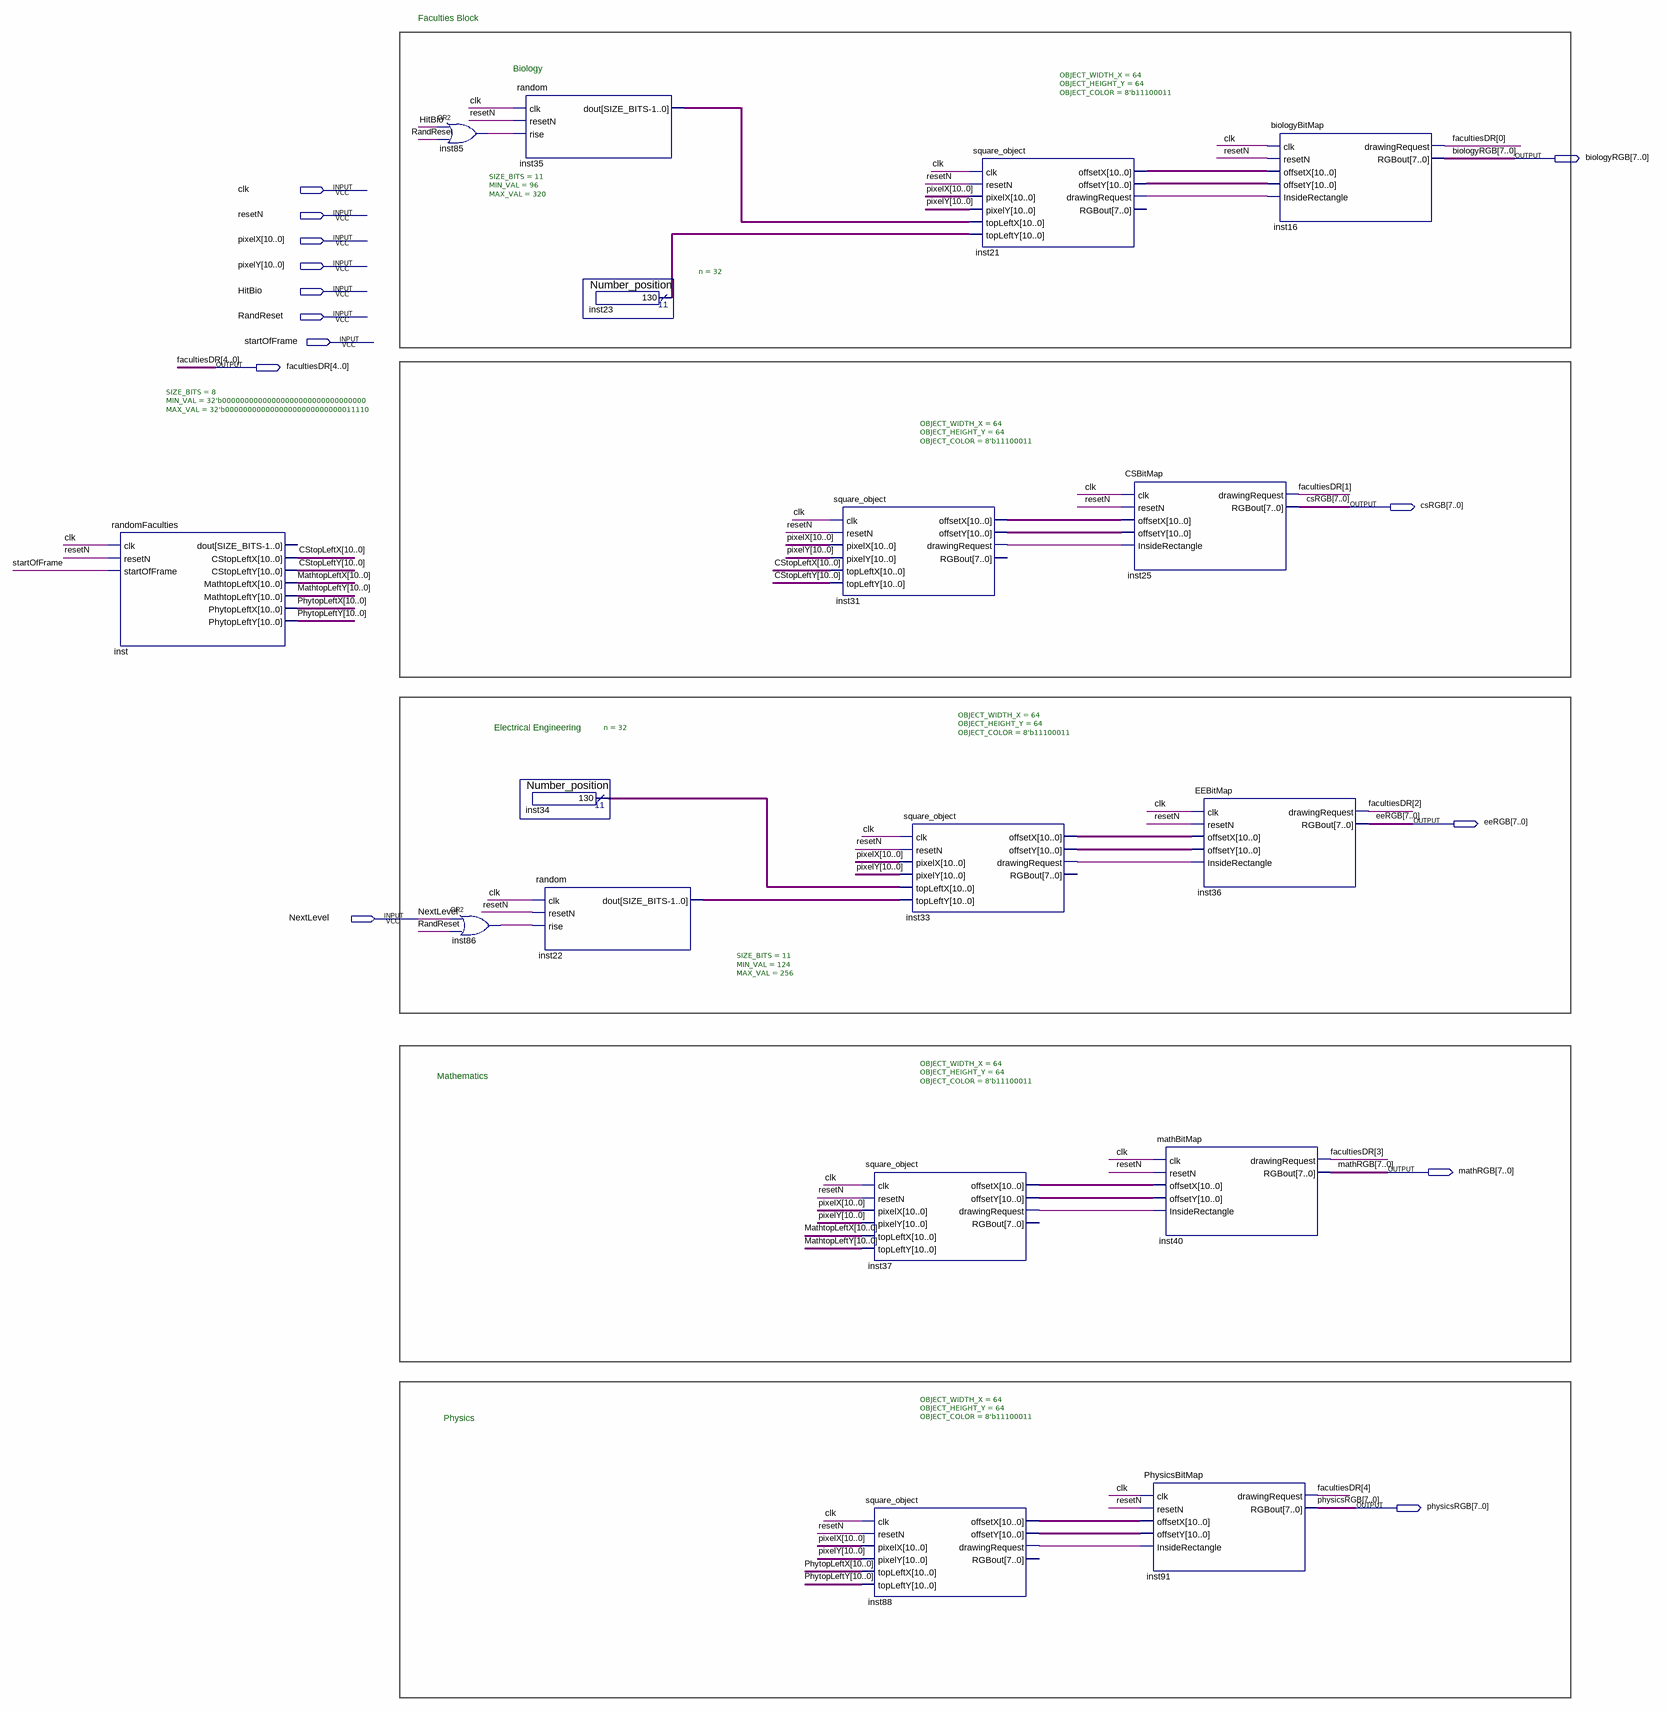
[diagram p0: schematic sheet]
// Quartus schematic Faculties_Block.bdf as structural Verilog: 17 symbols, 14 pins
module Faculties_Block (
  input  clk,
  input  resetN,
  input  [10:0] pixelX,
  input  [10:0] pixelY,
  input  HitBio,
  input  RandReset,
  input  startOfFrame,
  input  NextLevel,
  output [7:0] biologyRGB,
  output [4:0] facultiesDR,
  output [7:0] csRGB,
  output [7:0] eeRGB,
  output [7:0] mathRGB,
  output [7:0] physicsRGB
);

  wire inst21_drawingrequest, inst31_drawingrequest, inst33_drawingrequest, inst37_drawingrequest,
       inst85_out, inst86_out, inst88_drawingrequest;
  wire [10:0] CStopLeftX, CStopLeftY, inst21_offsetx, inst21_offsety, inst22_dout, inst23_result,
       inst31_offsetx, inst31_offsety, inst33_offsetx, inst33_offsety, inst34_result, inst35_dout,
       inst37_offsetx, inst37_offsety, inst88_offsetx, inst88_offsety, MathtopLeftX, MathtopLeftY,
       PhytopLeftX, PhytopLeftY;

  randomFaculties #(.SIZE_BITS(8), .MIN_VAL(32'b00000000000000000000000000000000), .MAX_VAL(32'b00000000000000000000000000011110)) inst (
    .clk(clk), .resetN(resetN), .startOfFrame(startOfFrame), .CStopLeftX(CStopLeftX),
    .CStopLeftY(CStopLeftY), .MathtopLeftX(MathtopLeftX), .MathtopLeftY(MathtopLeftY),
    .PhytopLeftX(PhytopLeftX), .PhytopLeftY(PhytopLeftY));  // open: dout
  or inst85 (inst85_out, HitBio, RandReset);
  or inst86 (inst86_out, NextLevel, RandReset);
  random #(.SIZE_BITS(11), .MIN_VAL(96), .MAX_VAL(320)) inst35 (
    .clk(clk), .resetN(resetN), .rise(inst85_out), .dout(inst35_dout));
  Number_position #(.n(32)) inst34 (.result(inst34_result));
  random #(.SIZE_BITS(11), .MIN_VAL(124), .MAX_VAL(256)) inst22 (
    .clk(clk), .resetN(resetN), .rise(inst86_out), .dout(inst22_dout));
  Number_position #(.n(32)) inst23 (.result(inst23_result));
  square_object #(.OBJECT_WIDTH_X(64), .OBJECT_HEIGHT_Y(64), .OBJECT_COLOR(8'b11100011)) inst31 (
    .clk(clk), .resetN(resetN), .pixelX(pixelX), .pixelY(pixelY), .topLeftX(CStopLeftX),
    .topLeftY(CStopLeftY), .offsetX(inst31_offsetx), .offsetY(inst31_offsety),
    .drawingRequest(inst31_drawingrequest));  // open: RGBout
  square_object #(.OBJECT_WIDTH_X(64), .OBJECT_HEIGHT_Y(64), .OBJECT_COLOR(8'b11100011)) inst33 (
    .clk(clk), .resetN(resetN), .pixelX(pixelX), .pixelY(pixelY), .topLeftX(inst34_result),
    .topLeftY(inst22_dout), .offsetX(inst33_offsetx), .offsetY(inst33_offsety),
    .drawingRequest(inst33_drawingrequest));  // open: RGBout
  square_object #(.OBJECT_WIDTH_X(64), .OBJECT_HEIGHT_Y(64), .OBJECT_COLOR(8'b11100011)) inst37 (
    .clk(clk), .resetN(resetN), .pixelX(pixelX), .pixelY(pixelY), .topLeftX(MathtopLeftX),
    .topLeftY(MathtopLeftY), .offsetX(inst37_offsetx), .offsetY(inst37_offsety),
    .drawingRequest(inst37_drawingrequest));  // open: RGBout
  square_object #(.OBJECT_WIDTH_X(64), .OBJECT_HEIGHT_Y(64), .OBJECT_COLOR(8'b11100011)) inst88 (
    .clk(clk), .resetN(resetN), .pixelX(pixelX), .pixelY(pixelY), .topLeftX(PhytopLeftX),
    .topLeftY(PhytopLeftY), .offsetX(inst88_offsetx), .offsetY(inst88_offsety),
    .drawingRequest(inst88_drawingrequest));  // open: RGBout
  square_object #(.OBJECT_WIDTH_X(64), .OBJECT_HEIGHT_Y(64), .OBJECT_COLOR(8'b11100011)) inst21 (
    .clk(clk), .resetN(resetN), .pixelX(pixelX), .pixelY(pixelY), .topLeftX(inst35_dout),
    .topLeftY(inst23_result), .offsetX(inst21_offsetx), .offsetY(inst21_offsety),
    .drawingRequest(inst21_drawingrequest));  // open: RGBout
  CSBitMap inst25 (
    .clk(clk), .resetN(resetN), .offsetX(inst31_offsetx), .offsetY(inst31_offsety),
    .InsideRectangle(inst31_drawingrequest), .drawingRequest(facultiesDR[1]), .RGBout(csRGB));
  mathBitMap inst40 (
    .clk(clk), .resetN(resetN), .offsetX(inst37_offsetx), .offsetY(inst37_offsety),
    .InsideRectangle(inst37_drawingrequest), .drawingRequest(facultiesDR[3]), .RGBout(mathRGB));
  PhysicsBitMap inst91 (
    .clk(clk), .resetN(resetN), .offsetX(inst88_offsetx), .offsetY(inst88_offsety),
    .InsideRectangle(inst88_drawingrequest), .drawingRequest(facultiesDR[4]), .RGBout(physicsRGB));
  EEBitMap inst36 (
    .clk(clk), .resetN(resetN), .offsetX(inst33_offsetx), .offsetY(inst33_offsety),
    .InsideRectangle(inst33_drawingrequest), .drawingRequest(facultiesDR[2]), .RGBout(eeRGB));
  biologyBitMap inst16 (
    .clk(clk), .resetN(resetN), .offsetX(inst21_offsetx), .offsetY(inst21_offsety),
    .InsideRectangle(inst21_drawingrequest), .drawingRequest(facultiesDR[0]), .RGBout(biologyRGB));

  // Notes on the sheet:
  //   Faculties Block
  //   Biology
  //   Electrical Engineering
  //   Mathematics
  //   Physics
endmodule
